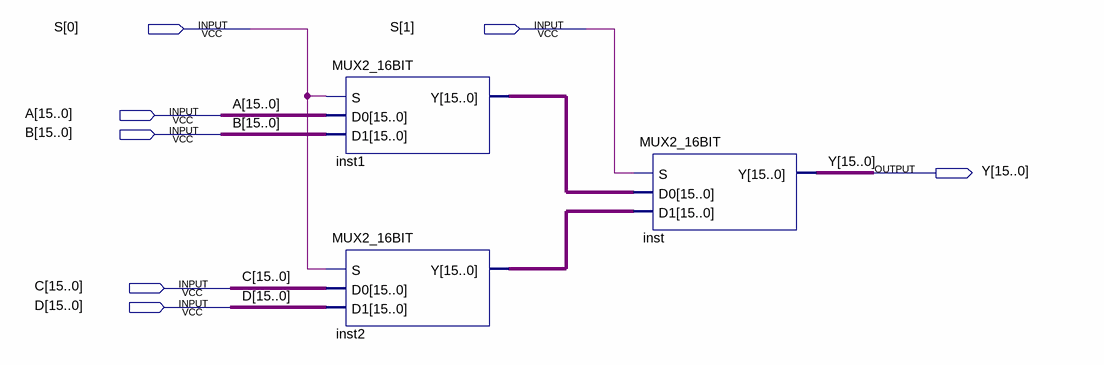
[diagram p0: schematic sheet]
// Quartus schematic MUX4_16BIT.bdf as structural Verilog: 3 symbols, 7 pins
module MUX4_16BIT (
  input  [1:0] S,
  input  [15:0] A,
  input  [15:0] B,
  input  [15:0] C,
  input  [15:0] D,
  output [15:0] Y
);

  wire [15:0] inst1_y, inst2_y;

  MUX2_16BIT inst1 (.S(S[0]), .D1(B), .D0(A), .Y(inst1_y));
  MUX2_16BIT inst2 (.S(S[0]), .D1(D), .D0(C), .Y(inst2_y));
  MUX2_16BIT inst (.S(S[1]), .D1(inst2_y), .D0(inst1_y), .Y(Y));
endmodule
